# EAGLE design version_1_2 (EAGLE 7.6.0)
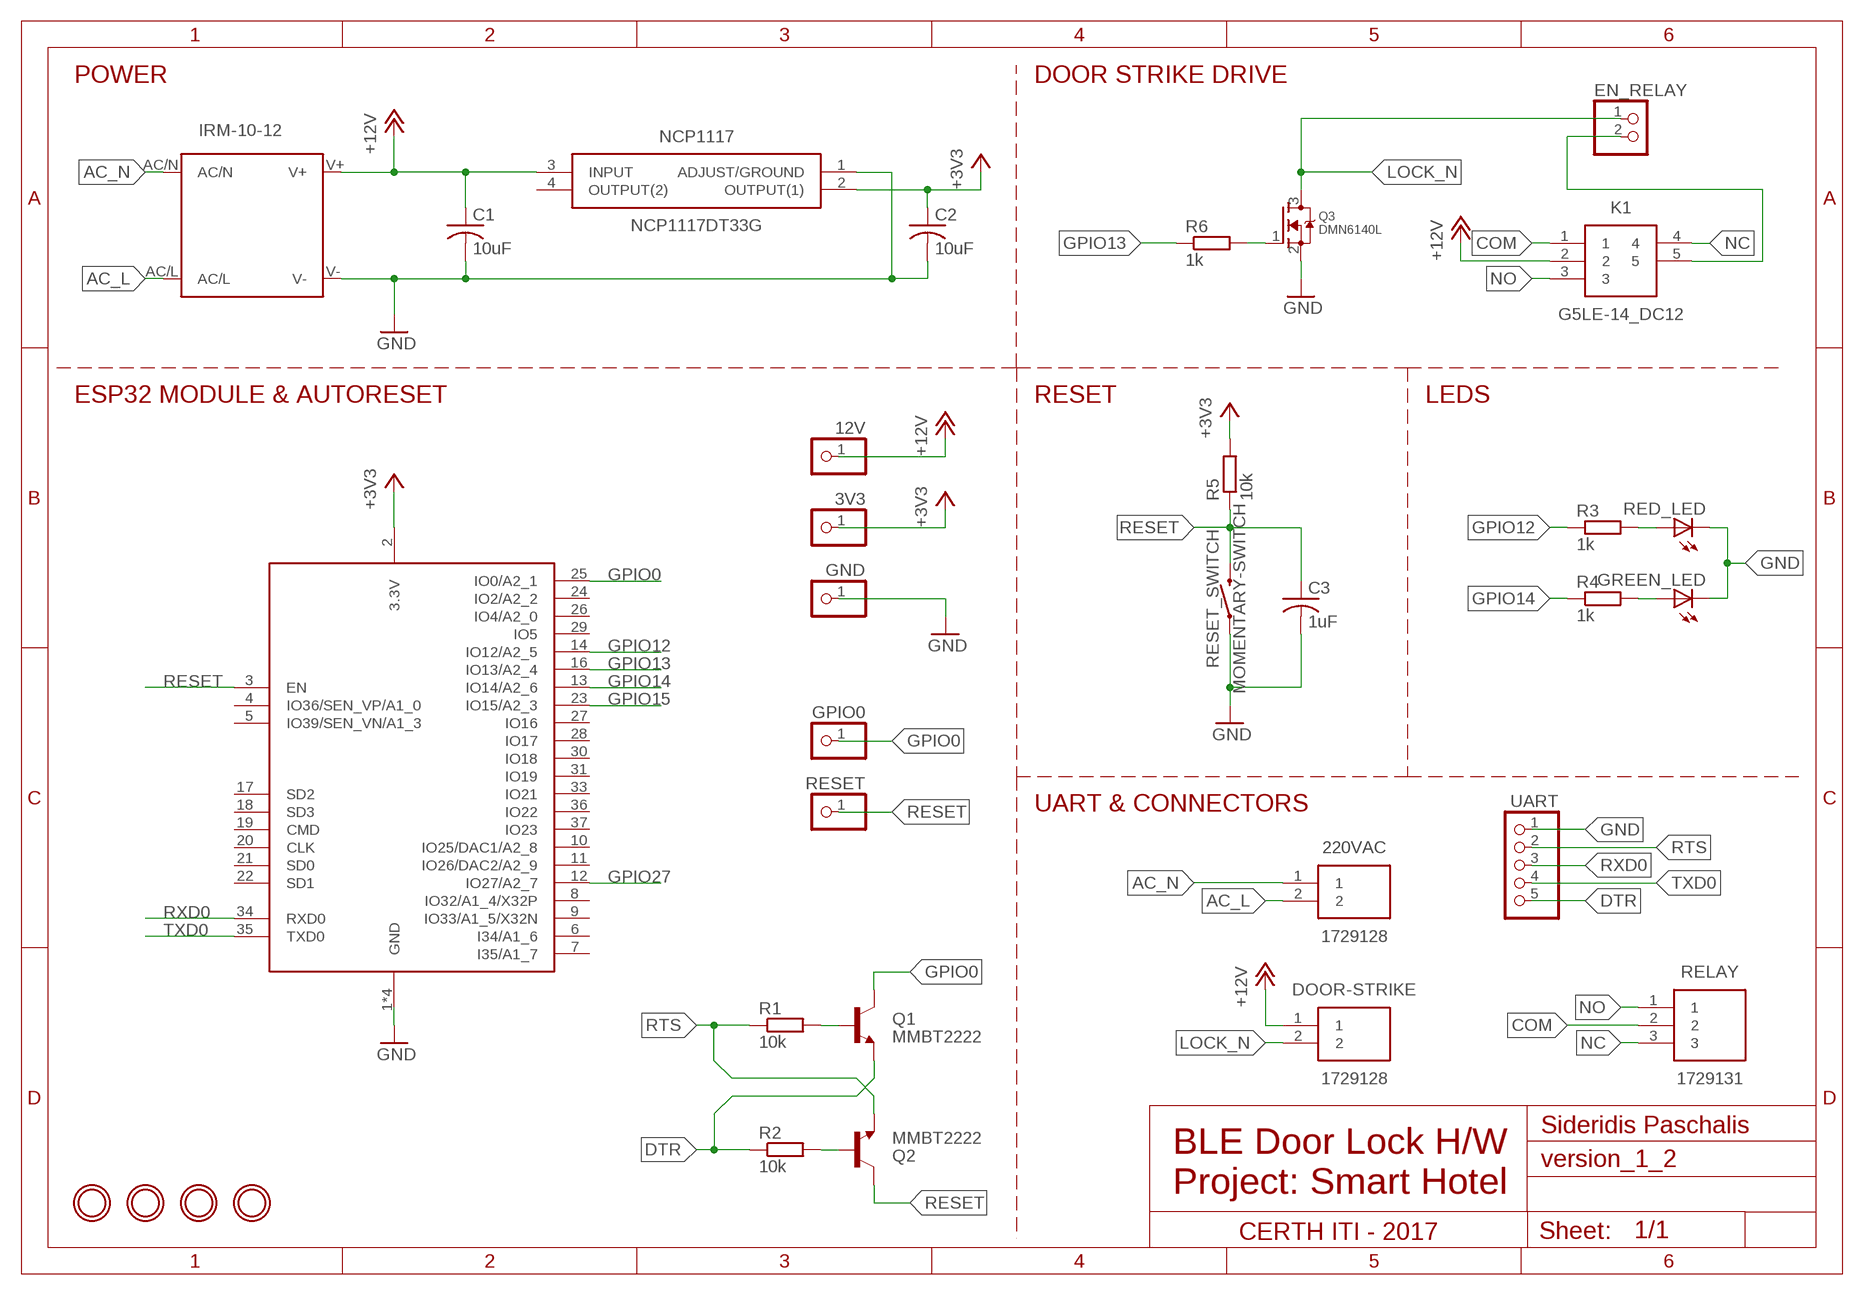
[diagram p0: schematic, sheet 1]

## Parts
3V3  PINHD-1X1  [1X01]
12V  PINHD-1X1  [1X01]
220VAC  1729128  [HDRV2W110P0X508_1X2_1016X810X1]
C1  10uF  C-USC0805  [C0805]
C2  10uF  C-USC0805  [C0805]
C3  1uF  C-USC0805  [C0805]
DOOR-STRIKE  1729128  [HDRV2W110P0X508_1X2_1016X810X1]
EN_RELAY  PINHD-1X2  [1X02]
ESP32  ESP32_WROOM32_SKINNY  [WROOM32_SKINNY]
GND  PINHD-1X1  [1X01]
GPIO0  PINHD-1X1  [1X01]
GREEN_LED  LED5MM  [LED5MM]
IRM-10-12  IRM_05/10  [IRM_05/10]
K1  G5LE-14_DC12  [G5LE-1A]
NCP1117  NCP1117DT33G  [TO229P990X238-4N]
Q1  MMBT2222  TRANSISTOR_NPNSOT23  [SOT23]
Q2  MMBT2222  TRANSISTOR_NPNSOT23  [SOT23]
Q3  DMN6140L  MOSFET-NREFLOW  [SOT23]
R1  10k  R-EU_R0805  [R0805]
R2  10k  R-EU_R0805  [R0805]
R3  1k  R-EU_R0805  [R0805]
R4  1k  R-EU_R0805  [R0805]
R5  10k  R-EU_R0805  [R0805]
R6  1k  R-EU_R0805  [R0805]
RED_LED  LED5MM  [LED5MM]
RELAY  1729131  [SHDR3W110P0X508_1X3_1524X810X1]
RESET  PINHD-1X1  [1X01]
RESET_SWITCH  MOMENTARY-SWITCH  MOMENTARY-SWITCH-SPST-SMD-6.2MM-TALL  [TACTILE_SWITCH_SMD_6.2MM_TALL]
U$1  MOUNTINGHOLE2.5  [MOUNTINGHOLE_2.5_PLATED]
U$2  MOUNTINGHOLE2.5  [MOUNTINGHOLE_2.5_PLATED]
U$3  MOUNTINGHOLE2.5  [MOUNTINGHOLE_2.5_PLATED]
U$4  MOUNTINGHOLE2.5  [MOUNTINGHOLE_2.5_PLATED]
UART  PINHD-1X5  [1X05]

## Nets
+3V3: 3V3.1 C2.1 ESP32.2(3.3V) NCP1117.2(OUTPUT(1)) R5.2
+12V: 12V.1 C1.1 DOOR-STRIKE.1 IRM-10-12.V+ K1.2 NCP1117.3(INPUT)
AC_L: 220VAC.2 IRM-10-12.AC/L
AC_N: 220VAC.1 IRM-10-12.AC/N
COM: K1.1 RELAY.2
DTR: Q1.2(E) R2.1 UART.5
GND: C1.2 C2.2 C3.2 ESP32.1(GND) ESP32.15(GND) ESP32.38(GND) ESP32.P$1(GND) GND.1 GREEN_LED.K(C) IRM-10-12.V- NCP1117.1(ADJUST/GROUND) Q3.2(S) RED_LED.K(C) RESET_SWITCH.A2 UART.1
GPIO0: ESP32.25(IO0/A2_1) GPIO0.1 Q1.3(C)
GPIO12: ESP32.14(IO12/A2_5) R3.1
GPIO13: ESP32.16(IO13/A2_4) R6.1
GPIO14: ESP32.13(IO14/A2_6) R4.1
GPIO15: ESP32.23(IO15/A2_3)
GPIO27: ESP32.12(IO27/A2_7)
LOCK_N: DOOR-STRIKE.2 EN_RELAY.1 Q3.3(D)
N$1: R3.2 RED_LED.A
N$2: Q1.1(B) R1.2
N$3: Q2.1(B) R2.2
N$4: GREEN_LED.A R4.2
N$6: Q3.1(G) R6.2
N$8: EN_RELAY.2 K1.5
NC: K1.4 RELAY.3
NO: K1.3 RELAY.1
RESET: C3.1 ESP32.3(EN) Q2.3(C) R5.1 RESET.1 RESET_SWITCH.B2
RTS: Q2.2(E) R1.1 UART.2
RXD0: ESP32.34(RXD0) UART.3
TXD0: ESP32.35(TXD0) UART.4
Unconnected: ESP32.4(IO36/SEN_VP/A1_0) ESP32.5(IO39/SEN_VN/A1_3) ESP32.6(I34/A1_6) ESP32.7(I35/A1_7) ESP32.8(IO32/A1_4/X32P) ESP32.9(IO33/A1_5/X32N) ESP32.10(IO25/DAC1/A2_8) ESP32.11(IO26/DAC2/A2_9) ESP32.17(SD2) ESP32.18(SD3) ESP32.19(CMD) ESP32.20(CLK) ESP32.21(SD0) ESP32.22(SD1) ESP32.24(IO2/A2_2) ESP32.26(IO4/A2_0) ESP32.27(IO16) ESP32.28(IO17) ESP32.29(IO5) ESP32.30(IO18) ESP32.31(IO19) ESP32.33(IO21) ESP32.36(IO22) ESP32.37(IO23) NCP1117.4(OUTPUT(2))

## Notes on the sheet
- POWER | DOOR STRIKE DRIVE
- ESP32 MODULE & AUTORESET | RESET | LEDS
- UART & CONNECTORS
- Sideridis Paschalis
- BLE Door Lock H/W
  Project: Smart Hotel
- CERTH ITI - 2017

## Library data of the parts
3V3 12V GND GPIO0 RESET = adafruit:PINHD-1X1: Pin header 1x1 for 0.1" spacing With round pins
220VAC DOOR-STRIKE = 1729128:1729128: 2way low profile vertical mount terminal Phoenix Contact Non-Fused Terminal Block, 2 Way, Solder Terminals, 30 ??? 14 AWG Through Hole, Nylon, 630 V <https://componentsearchengine.com/Images/1/1729128.jpg> Source: Datasheet <http://docs-europe.electrocomponents.com/webdocs/1380/0900766b81380189.pdf>; ALLIED_NUMBER: 70054405; DESCRIPTION: 2way low profile vertical mount terminal Phoenix Contact Non-Fused Terminal Block, 2 Way, Solder Terminals, 30 ??? 14 AWG Through Hole, Nylon, 630 V; HEIGHT: 10mm; MANUFACTURER_NAME: Phoenix Contact; MANUFACTURER_PART_NUMBER: 1729128; RS_PART_NUMBER: 1930586; SUPPLIER_NAME: RS
C1-C3 = rcl:C-US: CAPACITOR, American symbol
EN_RELAY = pinhead:PINHD-1X2: PIN HEADER
ESP32 = Adafruit HUZZAH32 ESP32 Feather:ESP32_WROOM32
GREEN_LED RED_LED = adafruit:LED: LED OSRAM: - CHIPLED LG R971, LG N971, LY N971, LG Q971, LY Q971, LO R971, LY R971 LH N974, LH R974 LS Q976, LO Q976, LY Q976 LO Q996 - Hyper CHIPLED LW Q18S LB Q993, LB Q99A, LB R99A - SideLED LS A670, LO A670, LY A670, LG A670, LP A670 LB A673, LV A673, LT A673, LW A673 LH A674 LY A675 LS A676, LA A676, LO A676, LY A676, LW A676 LS A679, LY A679, LG A679 - Hyper Micro SIDELED® LS Y876, LA Y876, LO Y876, LY Y876 LT Y87S - SmartLED LW L88C, LW L88S LB L89C, LB L89S, LG L890 LS L89K, LO L89K, LY L89K LS L896, LA L896, LO L896, LY L896 - TOPLED LS T670, LO T670, LY T670, LG T670, LP T670 LSG T670, LSP T670, LSY T670, LOP T670, LYG T670 LG T671, LOG T671, LSG T671 LB T673, LV T673, LT T673, LW T673 LH T674 LS T676, LA T676, LO T676, LY T676, LB T676, LH T676, LSB T676, LW T676 LB T67C, LV T67C, LT T67C, LS T67K, LO T67K, LY T67K, LW E67C LS E67B, LA E67B, LO E67B, LY E67B, LB E67C, LV E67C, LT E67C LW T67C LS T679, LY T679, LG T679 LS T770, LO T770, LY T770, LG T770, LP T770 LB T773, LV T773, LT T773, LW T773 LH T774 LS E675, LA E675, LY E675, LS T675 LS T776, LA T776, LO T776, LY T776, LB T776 LHGB T686 LT T68C, LB T68C - Hyper Mini TOPLED® LB M676 - Mini TOPLED Santana® LG M470 LS M47K, LO M47K, LY M47K Source: http://www.osram.convergy.de/
IRM-10-12 = meanwell_irm_v5:IRM_05/10: 5 or 10 watt housing & pin compatible IRM 05 Vout [V] Imax [A] Pmax [W] Eff [%] 3.3 1.25 4.125 68 5 1 5 71 12 0.42 5.04 75 15 0.33 4.95 75 24 0.23 5.52 77 IRM 10 Vout [V] Imax [A] Pmax [W] Eff [%] 3.3 2.5 8.25 74 5 2 10 77 12 0.85 10.2 82 15 0.67 10.05 82 24 0.42 10.08 82
K1 = G5LE-14_DC12:G5LE-14_DC12: Cubic, Single-pole 10A Power Relay <https://componentsearchengine.com/Images/9/G5LE-14+DC12.jpg> Source: Datasheet <http://www.omron.com/ecb/products/pdf/en-g5le.pdf>; DESCRIPTION: Cubic, Single-pole 10A Power Relay; HEIGHT: mm; MANUFACTURER_NAME: Omron Electronics Inc-EMC Div; MANUFACTURER_PART_NUMBER: G5LE-14 DC12; SUPPLIER_NAME: RS
NCP1117 = NCP1117DT33G:NCP1117DT33G: 1A,3.3V,LDO Voltage Reg.,NCP1117DT33 NCP1117DT33G, Low Dropout Voltage Regulator, 1A, 3.3 V 1%, 3-Pin DPAK <https://componentsearchengine.com/Images/3/NCP1117DT33G.jpg> Source: Datasheet <http://www.onsemi.com/pub/Collateral/NCP1117-D.PDF>; ALLIED_NUMBER: 70340549; DESCRIPTION: 1A,3.3V,LDO Voltage Reg.,NCP1117DT33 NCP1117DT33G, Low Dropout Voltage Regulator, 1A, 3.3 V 1%, 3-Pin DPAK; HEIGHT: 2.38mm; MANUFACTURER_NAME: ON Semiconductor; MANUFACTURER_PART_NUMBER: NCP1117DT33G; RS_PART_NUMBER: 1023504; SUPPLIER_NAME: RS
Q1 Q2 = Adafruit HUZZAH32 ESP32 Feather:TRANSISTOR_NPN: Transistor NPN BJT configuration in SOT23 package. MMBT2222 is the common NPN we use. Double check BCE configuration again layout.
Q3 = adafruit:MOSFET-N: N-Channel Mosfet 2N7002E - 60V 260mA SOT23 [Digikey: 2N7002ET1GOSTR-ND] - REEL BSH103 - 30V 850mA SOT23 [Digikey: 568-5013-1-ND]
R1-R6 = rcl:R-EU_: RESISTOR, European symbol
RELAY = 1729131:1729131: 3way low profile vertical mount terminal Phoenix Contact Non-Fused Terminal Block, 3 Way, Solder Terminals, 30 14 AWG Through Hole, Nylon, 630 V <https://componentsearchengine.com/Images/1/1729131.jpg> Source: Datasheet <https://www.phoenixcontact.com/online/portal/us?uri=pxc-oc-itemdetail:pid=1729131>; DESCRIPTION: 3way low profile vertical mount terminal Phoenix Contact Non-Fused Terminal Block, 3 Way, Solder Terminals, 30 14 AWG Through Hole, Nylon, 630 V; HEIGHT: 10mm; MANUFACTURER_NAME: Phoenix Contact; MANUFACTURER_PART_NUMBER: 1729131; RS_PART_NUMBER: 1930592; SUPPLIER_NAME: RS
RESET_SWITCH = SparkFun-Switches:MOMENTARY-SWITCH-SPST: Momentary Switch (Pushbutton) - SPST Normally-open (NO) SPST momentary switches (buttons, pushbuttons). Variants PTH-12MM - 12mm square, through-hole Momentary Pushbutton Switch - 12mm Square <https://www.sparkfun.com/products/9190> (COM-09190) PTH-6.0MM, PTH-6.0MM-KIT - 6.0mm square, through-hole Mini Pushbutton Switch <https://www.sparkfun.com/products/97> (COM-00097) KIT package intended for soldering kit's - only one side of pads' copper is exposed. PTH-RIGHT-ANGLE-KIT - Right-angle, through-hole Right Angle Tactile Button <https://www.sparkfun.com/products/10791> - Used on SparkFun BigTime Watch Kit <https://www.sparkfun.com/products/11734> SMD-12MM - 12mm square, surface-mount Tactile Button - SMD (12mm) <https://www.sparkfun.com/products/12993> (COM-12993) Used on SparkFun PicoBoard <https://www.sparkfun.com/products/11888> SMD-4.5MM - 4.5mm Square Trackball Switch Used on SparkFun Blackberry Trackballer Breakout <https://www.sparkfun.com/products/13169> SMD-4.6MMX2.8MM - 4.60mm x 2.80mm, surface mount Used on SparkFun SAMD21 Mini Breakout <https://www.sparkfun.com/products/13664> SMD-5.2MM, SMD-5.2-REDUNDANT - 5.2mm square, surface-mount Mini Pushbutton Switch - SMD <https://www.sparkfun.com/products/8720> (COM-08720) Used on Arduino Pro Mini <https://www.sparkfun.com/products/11114> REDUNDANT package connects both switch circuits together SMD-6.0X3.5MM - 6.0 x 3.5mm, surface mount Momentary Reset Switch SMD <https://www.sparkfun.com/products/8229> (COM-08229) SMD-6.2MM-TALL - 6.2mm square, surface mount Tactile Button - SMD (6mm) <https://www.sparkfun.com/products/12992> Used on SparkFun Digital Sandbox <https://www.sparkfun.com/products/12651> SMD-RIGHT-ANGLE - Right-angle, surface mount Used on SparkFun Block for Intel® Edison - Arduino <https://www.sparkfun.com/products/13036>; PROD_ID: SWCH-11966; SF_SKU: COM-12992
U$1-U$4 = Adafruit HUZZAH32 ESP32 Feather:MOUNTINGHOLE: Mounting Hole For #2 screws (0.086"/2.18mm width, 0.094"/2.4mm hole) use 2.5mm; BOM: EXCLUDE
UART = pinhead:PINHD-1X5: PIN HEADER

## Board
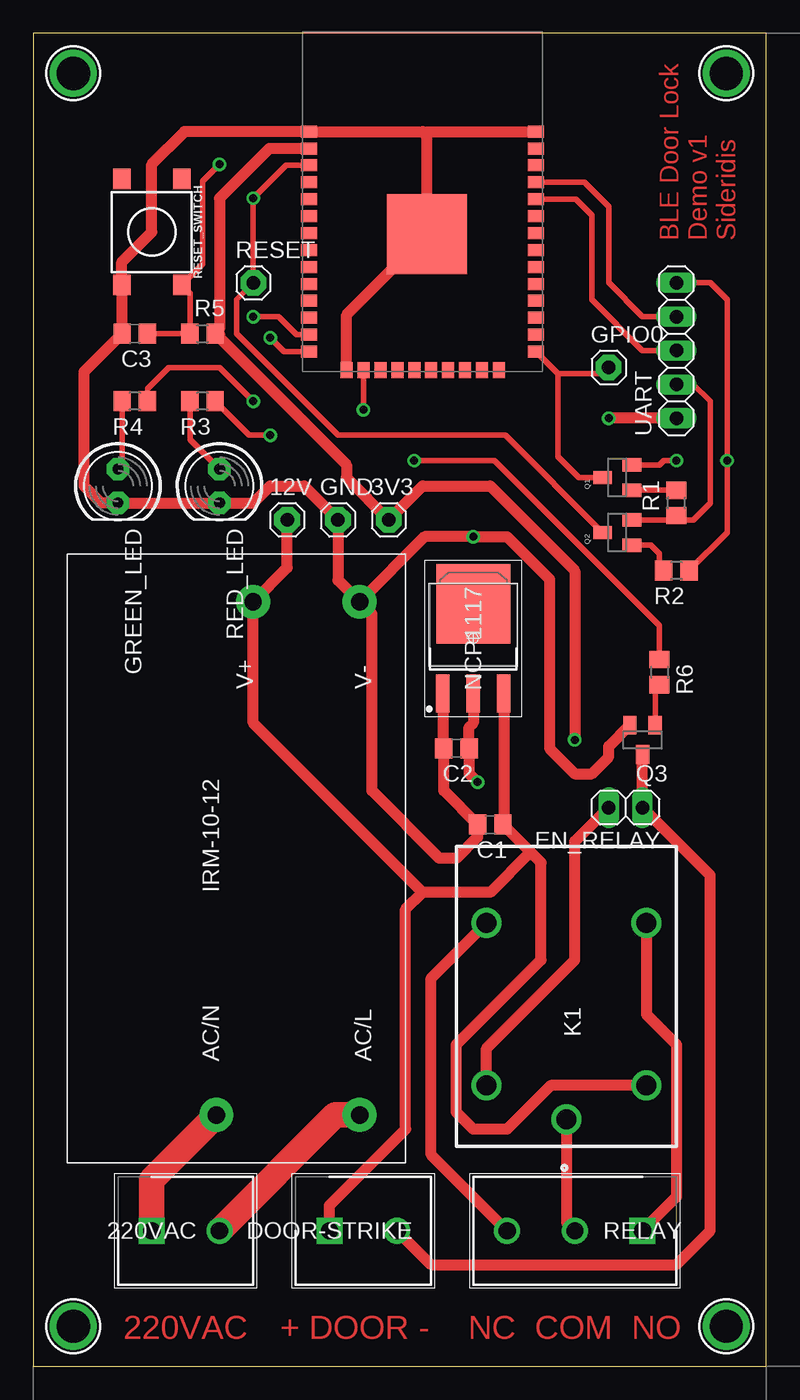
[diagram p1: board, top side]
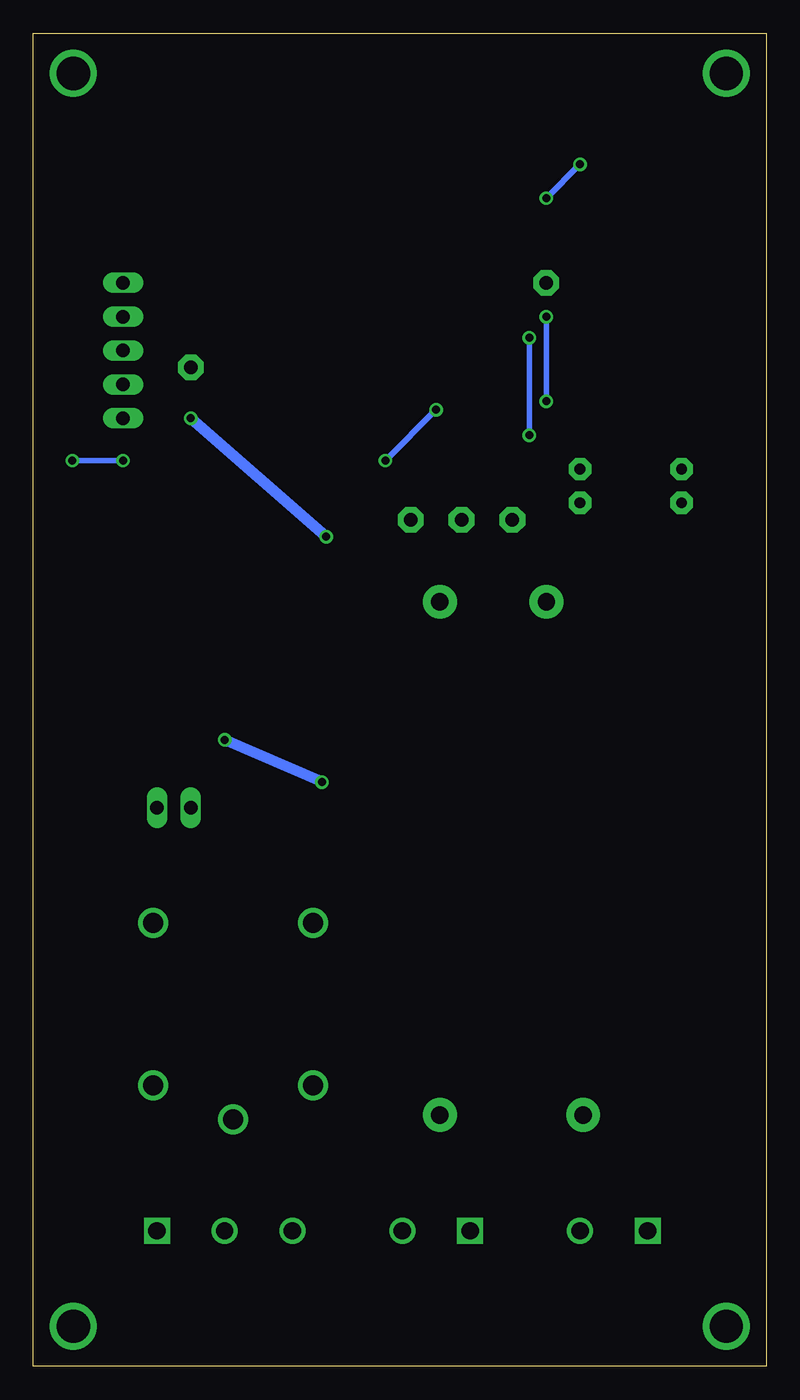
[diagram p2: board, bottom side, seen from below]

Size 55 x 100 mm. Coordinates in mm from the lower left corner, seen from the top.
Outline: 0,0 55,0 55,100 0,100 0,0
Copper layers (1*16): Top 0.035mm / dielectric 1.5mm / Bottom 0.035mm
Design rules "default": minimum track width 10mil, minimum drill 24mil, track to track 8mil, track to pad 8mil, pad to pad 8mil, via to via 8mil, smd to smd 8mil, copper to edge 40mil, drill to drill 8mil, minimum pad ring 10mil, minimum via ring 8mil, stop-mask expansion 4mil, vias tented up to drill 0mil, thermal gap 10mil

### Footprints (pad centres in the part's own frame; a part is rotated, then mirrored left to right if it is on the bottom)
1X01 = drill 1.016 pad 1.93 octagon: 1 0,0
HDRV2W110P0X508_1X2_1016X810X1 = drill 1.3 pad 1.95 square: 1 0,0 | drill 1.3 pad 1.95: 2 5.08,0
C0805 = smd 1.3 x 1.5: 1 -0.95,0; 2 0.95,0
1X02 = drill 1.016 long: 1 -1.27,0; 2 1.27,0
WROOM32_SKINNY = smd 1.2 x 0.9: 1 -8.5,5; 2 -8.5,3.73; 3 -8.5,2.46; 4 -8.5,1.19; 5 -8.5,-0.08; 6 -8.5,-1.35; 7 -8.5,-2.62; 8 -8.5,-3.89; 9 -8.5,-5.16; 10 -8.5,-6.43; 11 -8.5,-7.7; 12 -8.5,-8.97; 13 -8.5,-10.24; 14 -8.5,-11.51; 25 8.5,-11.51; 26 8.5,-10.24; 27 8.5,-8.97; 28 8.5,-7.7; 29 8.5,-6.43; 30 8.5,-5.16; 31 8.5,-3.89; 32 8.5,-2.62; 33 8.5,-1.35; 34 8.5,-0.08; 35 8.5,1.19; 36 8.5,2.46; 37 8.5,3.73; 38 8.5,5 | smd 0.9 x 1.2: 15 -5.7,-12.9; 16 -4.43,-12.9; 17 -3.16,-12.9; 18 -1.89,-12.9; 19 -0.62,-12.9; 20 0.65,-12.9; 21 1.92,-12.9; 22 3.19,-12.9; 23 4.46,-12.9; 24 5.73,-12.9 | smd 6 x 6: P$1 0.34,-2.7
LED5MM = drill 0.813 pad 1.676 octagon: A -1.27,0; K 1.27,0
IRM_05/10 = drill 1.3 pad 2.54: AC/L -19.25,-9.25; AC/N -19.25,1.5; V+ 19.25,-1.25; V- 19.25,-9.25
G5LE-1A = drill 1.5 pad 2.25: 1 2,8.25; 2 4.55,2.25; 3 16.75,2.25; 4 16.75,14.25; 5 4.55,14.25
TO229P990X238-4N = smd 2.85 x 1: 1 -4.15,2.29; 2 -4.15,0; 3 -4.15,-2.29 | smd 5.95 x 5.55: 4 2.6,0
SOT23 = smd 1 x 1.4: 1 -0.95,-1.1; 2 0.95,-1.1; 3 0,1.1
R0805 = smd 1.3 x 1.5: 1 -0.95,0; 2 0.95,0
SHDR3W110P0X508_1X3_1524X810X1 = drill 1.3 pad 1.95 square: 1 0,0 | drill 1.3 pad 1.95: 2 5.08,0; 3 10.16,0
TACTILE_SWITCH_SMD_6.2MM_TALL = smd 1.55 x 1.3: A1 -3.975,-2.25; A2 3.975,-2.25; B1 -3.975,2.25; B2 3.975,2.25
MOUNTINGHOLE_2.5_PLATED = drill 2.5 pad 3.2: P$1 0,0
1X05 = drill 1.016 long: 1 -5.08,0; 2 -2.54,0; 3 0,0; 4 2.54,0; 5 5.08,0

### Placement (x,y rotation side)
3V3  26.67,63.5 0 top
12V  19.05,63.5 0 top
220VAC  8.89,10.16 0 top
C1  34.29,40.64 180 top
C2  31.75,46.35 180 top
C3  7.62,77.47 180 top
DOOR-STRIKE  22.23,10.16 0 top
EN_RELAY  44.45,41.91 180 top
ESP32  29.21,87.63 0 top
GND  22.86,63.5 0 top
GPIO0  43.18,74.93 0 top
GREEN_LED  6.35,66.04 270 top
IRM-10-12  15.24,38.1 90 top
K1  48.26,16.51 90 top
NCP1117  33.02,54.61 90 top
Q1  43.81,66.67 90 top
Q2  43.81,62.55 90 top
Q3  45.72,46.99 180 top
R1  48.26,64.77 90 top
R2  48.26,59.69 180 top
R3  12.7,72.39 180 top
R4  7.62,72.39 180 top
R5  12.7,77.47 0 top
R6  46.99,52.07 270 top
RED_LED  13.97,66.04 270 top
RELAY  45.72,10.16 180 top
RESET  16.51,81.28 0 top
RESET_SWITCH  8.89,85.09 270 top
U$1  52,97 0 top
U$2  3,3 0 top
U$3  52,3 0 top
U$4  3,97 0 top
UART  48.26,76.2 90 top

### Tracks (layer width: path | path; a pad name or v marks a point on that pad's centre or on a via)
+3V3  (via drill 0.6)
  Top 0.813: NCP1117.2 33.02,48.26 32.7,47.94 C2.1 32.7,44.45 v33.34,43.81 | ESP32.2 17.7,91.36 13.97,87.63 13.97,77.79 R5.2 13.97,77.47 13.97,77.15 23.5,67.63 23.5,66.67 3V3.1 29.21,66.04 34.29,66.04 40.64,59.69 v40.64,46.99
  Bottom 0.813: v33.34,43.81 v40.64,46.99
+12V
  Top 0.813: 12V.1 19.05,59.91 IRM-10-12.V+ 16.51,57.33 16.51,48.26 29.21,35.56 | 29.21,35.56 34.29,35.56 37.3,38.58 | NCP1117.3 35.31,40.71 C1.1 37.3,38.58 | DOOR-STRIKE.1 22.23,12.06 27.94,17.78 27.94,34.29 29.21,35.56 | 37.3,38.58 38.1,37.78 38.1,30.48 31.75,24.13 31.75,19.05 33.02,17.78 35.56,17.78 38.84,21.06 K1.2
AC_L
  Top 1.93: 220VAC.2 22.66,18.85 IRM-10-12.AC/L
AC_N
  Top 1.93: 220VAC.1 8.89,14 IRM-10-12.AC/N
COM
  Top 0.813: K1.1 40.01,10.79 RELAY.2
DTR  (via drill 0.6)
  Top 0.406: R2.1 52.07,62.55 v52.07,67.94 52.07,80.01 50.8,81.28 UART.5 | v48.26,67.94 47.31,67.94 46.99,67.62 Q1.2
  Bottom 0.406: v48.26,67.94 v52.07,67.94
GND  (via drill 0.6)
  Top 0.813: IRM-10-12.V- 22.86,58.98 GND.1 20.32,66.04 17.78,66.04 16.51,64.77 RED_LED.K GREEN_LED.K 5.08,64.77 3.81,66.04 3.81,74.61 C3.2 6.64,77.5 RESET_SWITCH.A2 6.64,82.84 8.89,85.09 8.89,90.17 11.35,92.63 ESP32.1 29.21,92.63 | IRM-10-12.V- 25.4,56.44 25.4,43.18 30.48,38.1 31.75,38.1 33.34,39.69 C1.2 30.8,43.18 C2.2 30.73,46.42 NCP1117.1 | 29.21,92.63 ESP32.38 | 29.21,92.63 29.55,92.29 ESP32.P$1 23.51,78.89 ESP32.15 | UART.1 v43.18,71.12 | IRM-10-12.V- 29.37,62.23 v33.02,62.23 35.56,62.23 38.73,59.05 38.73,46.35 40.64,44.45 41.91,44.45 43.18,45.72 43.18,46.5 Q3.2
  Bottom 0.813: v43.18,71.12 v33.02,62.23
GPIO0
  Top 0.406: 39.37,74.46 ESP32.25 | 39.37,74.46 42.71,74.46 GPIO0.1 | 39.37,74.46 39.37,68.26 40.96,66.67 Q1.3
GPIO12  (via drill 0.6)
  Top 0.406: R3.1 16.19,69.85 v17.78,69.85 | ESP32.14 18.81,76.12 v17.78,77.15
  Bottom 0.406: v17.78,69.85 v17.78,77.15
GPIO13  (via drill 0.6)
  Top 0.406: ESP32.16 24.78,71.77 v24.77,71.75 | v28.57,67.94 34.61,67.94 46.99,55.56 R6.1
  Bottom 0.406: v24.77,71.75 v28.57,67.94
GPIO14  (via drill 0.6)
  Top 0.406: R4.1 8.57,73.34 10.16,74.93 13.97,74.93 v16.51,72.39 | ESP32.13 19.77,77.39 18.41,78.74 v16.51,78.74
  Bottom 0.406: v16.51,72.39 v16.51,78.74
LOCK_N
  Top 0.813: DOOR-STRIKE.2 29.84,7.62 48.26,7.62 50.8,10.16 50.8,36.83 EN_RELAY.1 Q3.3
N$1
  Top 0.406: R3.2 11.75,69.53 RED_LED.A
N$2
  Top 0.406: Q1.1 R1.2
N$3
  Top 0.406: Q2.1 46.35,61.6 46.99,60.96 46.99,60.01 R2.2
N$4
  Top 0.406: R4.2 6.67,67.63 GREEN_LED.A
N$6
  Top 0.406: Q3.1 46.67,50.8 R6.2
N$8
  Top 0.813: K1.5 34.01,23.85 40.64,30.48 40.64,39.37 EN_RELAY.2
NC
  Top 0.813: RELAY.3 29.84,15.88 29.84,29.09 K1.4
NO
  Top 0.813: K1.3 46.01,26.38 48.26,24.13 48.26,12.7 RELAY.1
RESET  (via drill 0.6)
  Top 0.406: C3.1 R5.1 11.75,80.5 RESET_SWITCH.B2 12.7,82.67 12.7,88.9 v13.97,90.17 | ESP32.3 18.97,90.09 v16.51,87.63 RESET.1 15.24,80.01 15.24,77.47 22.86,69.85 35.41,69.85 Q2.3
  Bottom 0.406: v13.97,90.17 v16.51,87.63
RTS
  Top 0.406: UART.2 49.53,73.66 50.8,72.39 50.8,64.77 49.53,63.5 48.58,63.5 R1.1 47.94,63.5 Q2.2
RXD0
  Top 0.406: ESP32.34 40.72,87.55 41.91,86.36 41.91,80.01 45.72,76.2 UART.3
TXD0
  Top 0.406: UART.4 45.72,78.74 43.18,81.28 43.18,87 41.35,88.82 ESP32.35

### Text on the board
Top: BLE Door Lock / Demo v1 / Sideridis | 220VAC | + DOOR - | NC COM NO